# Altium project EE463_Project.PrjPcb
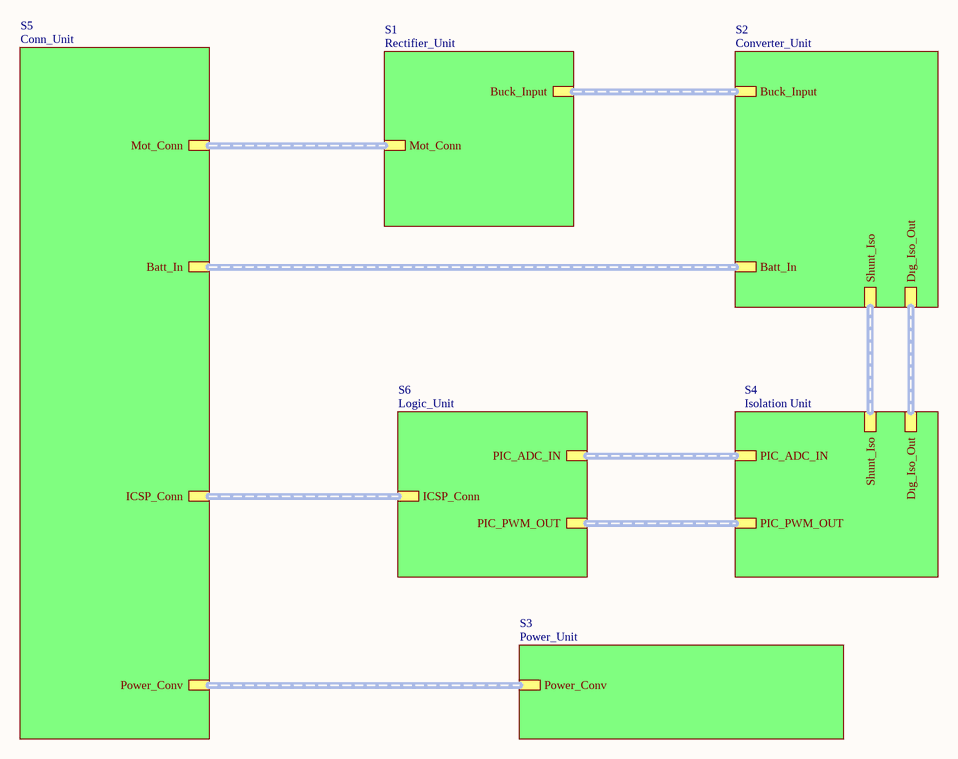
[diagram p0: EE463_Sch.SchDoc]
7 sheets, 52 parts. Net scope: hierarchical (ports join the sheet entries above them; power ports are global).
Board file: EE463_PCB.PcbDoc
Sheets:
  EE463_Sch.SchDoc
    S1 = Rectifier_Unit.SchDoc
    S2 = Converter_Unit.SchDoc
    S3 = Power_Unit.SchDoc
    S6 = Logic_Unit.SchDoc
    S5 = Conn_Unit.SchDoc
    S4 = Isolation Unit.SchDoc

## Sheet EE463_Sch.SchDoc
size A3

### Sub-sheets
S1 = Rectifier_Unit: Mot_Conn (harness Mot_Conn), Buck_Input (harness Rec_Buck)
S2 = Converter_Unit: Dıg_Iso_Out (harness DRV_In), Batt_In (harness Battery_In), Shunt_Iso (harness Shunt_Iso), Buck_Input (harness Rec_Buck)
S3 = Power_Unit: Power_Conv (harness Power_Conv)
S4 = Isolation Unit: Dıg_Iso_Out (harness DRV_In), PIC_ADC_IN (harness PIC_AN_IN), PIC_PWM_OUT (harness DIG_ISO_IN), Shunt_Iso (harness Shunt_Iso)
S5 = Conn_Unit: Mot_Conn (harness Mot_Conn), Batt_In (harness Battery_In), Power_Conv (harness Power_Conv), ICSP_Conn (harness ICSP_Conn)
S6 = Logic_Unit: PIC_ADC_IN (harness PIC_AN_IN), PIC_PWM_OUT (harness DIG_ISO_IN), ICSP_Conn (harness ICSP_Conn)

### Buses and harness runs
harness sheet S1/Buck_Input = sheet S2/Buck_Input
harness sheet S1/Mot_Conn = sheet S5/Mot_Conn
harness sheet S2/Batt_In = sheet S5/Batt_In
harness sheet S2/Dıg_Iso_Out = sheet S4/Dıg_Iso_Out
harness sheet S2/Shunt_Iso = sheet S4/Shunt_Iso
harness sheet S3/Power_Conv = sheet S5/Power_Conv
harness sheet S4/PIC_ADC_IN = sheet S6/PIC_ADC_IN
harness sheet S4/PIC_PWM_OUT = sheet S6/PIC_PWM_OUT
harness sheet S5/ICSP_Conn = sheet S6/ICSP_Conn

### Notes on the sheet
- Title
- Size:
- Date:
- A3
- Number:
- Time:
- Revision:
- Sheet
- of
- File:

## Sheet Rectifier_Unit.SchDoc
size A3
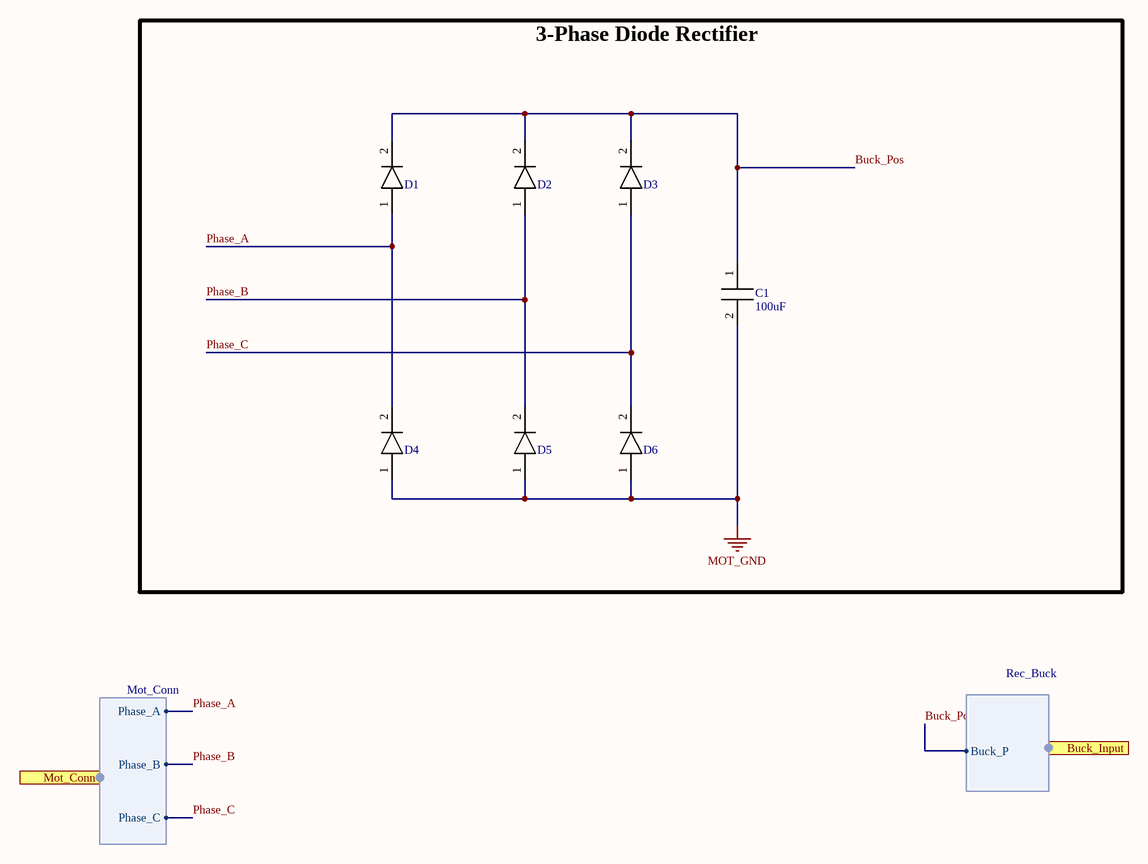
[diagram p1: Rectifier_Unit.SchDoc]

### Parts
C1  Parameter 1: 100uF  [EKXL401ELL101MM25S]  (hidden comment: CAP 100uf EKXL401ELL101MM25S)
D1  DI S2GTR  [S2GTR]  (value not drawn)
D2  DI S2GTR  [S2GTR]  (value not drawn)
D3  DI S2GTR  [S2GTR]  (value not drawn)
D4  DI S2GTR  [S2GTR]  (value not drawn)
D5  DI S2GTR  [S2GTR]  (value not drawn)
D6  DI S2GTR  [S2GTR]  (value not drawn)

### Ports
Buck_Input (harness Rec_Buck), Mot_Conn (harness Mot_Conn)

### Harnesses
Mot_Conn: Phase_A, Phase_B, Phase_C
Rec_Buck: Buck_P

### Nets
MOT_GND: C1.2 D4.1(Anode) D5.1(Anode) D6.1(Anode)
Buck_Pos: C1.1 D1.2(Cathode) D2.2(Cathode) D3.2(Cathode) ; port Buck_Input.Buck_P
Phase_A: D1.1(Anode) D4.2(Cathode) ; port Mot_Conn.Phase_A
Phase_B: D2.1(Anode) D5.2(Cathode) ; port Mot_Conn.Phase_B
Phase_C: D3.1(Anode) D6.2(Cathode) ; port Mot_Conn.Phase_C

### Notes on the sheet
- 3-Phase Diode Rectifier
- Title
- Size:
- Date:
- A3
- Number:
- Time:
- Revision:
- Sheet
- of
- File:

### Library data of the parts
D1-D6 = DI S2GTR: DI, S2GTR, 400V, 2A

## Sheet Converter_Unit.SchDoc
size A3
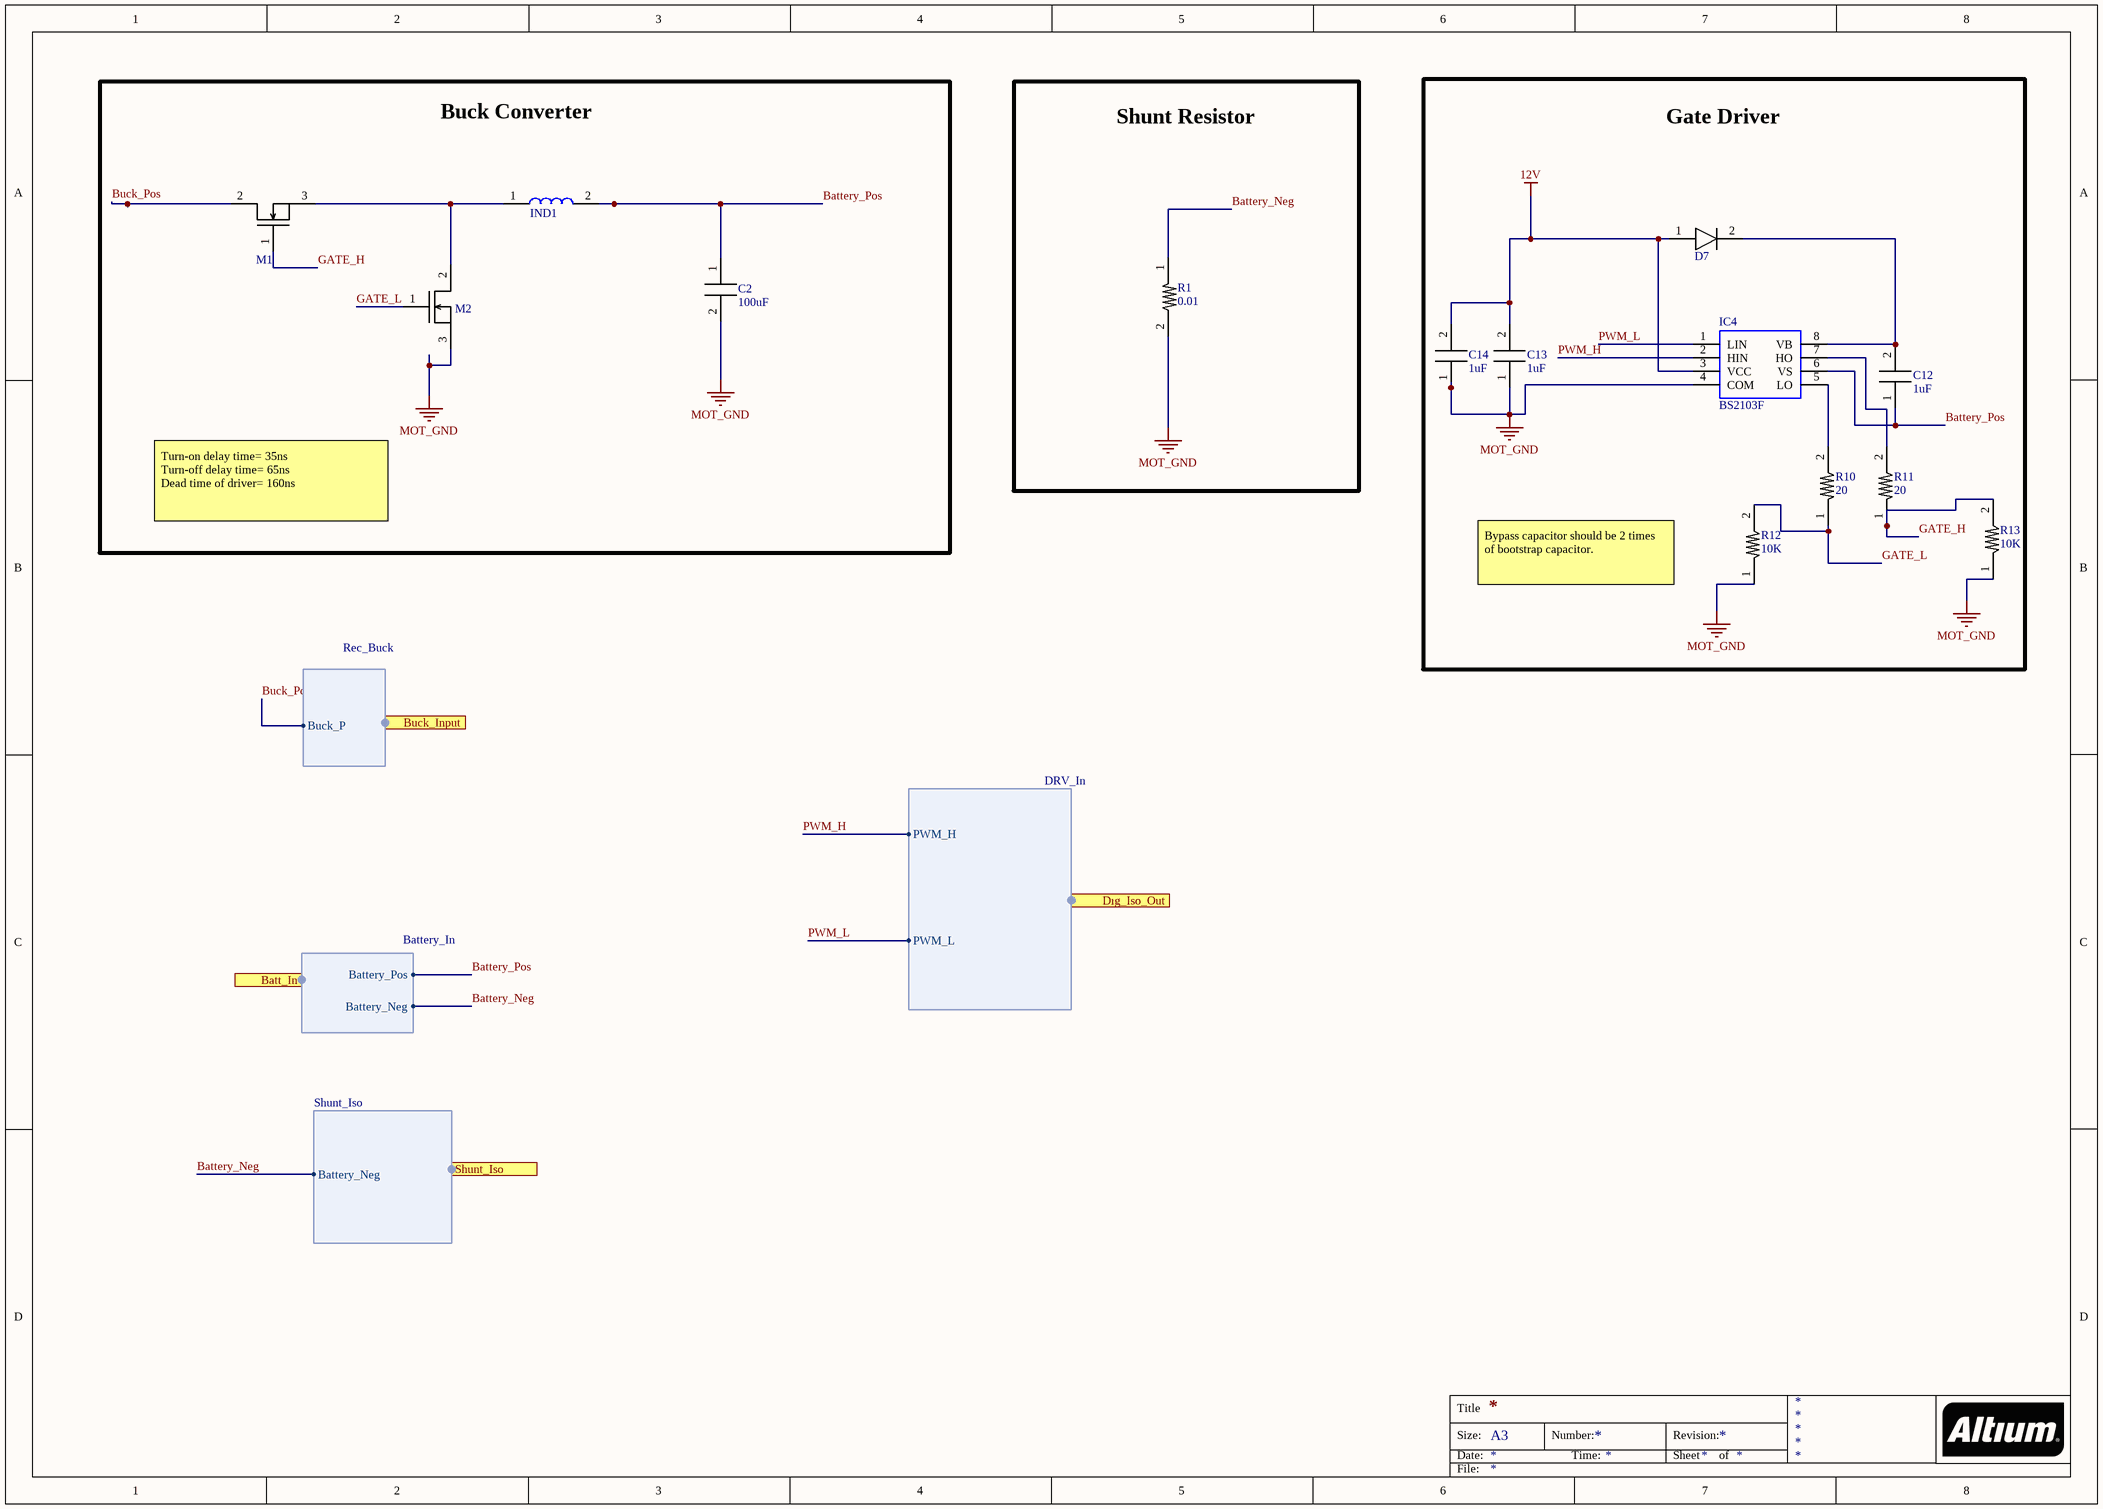
[diagram p2: Converter_Unit.SchDoc]

### Parts
C2  Parameter 1: 100uF  [860020573008]  (hidden comment: CAP 100uF 860020573008)
C12  Parameter 1: 1uF  [0603_CAP]  (hidden comment: CAP 1uF)
C13  Parameter 1: 1uF  [0603_CAP]  (hidden comment: CAP 1uF)
C14  Parameter 1: 1uF  [0603_CAP]  (hidden comment: CAP 1uF)
D7  DI S2GTR  [S2GTR]  (value not drawn)
IC4  BS2103F  [BS2103F]
IND1  IND, 1mH, B82615B2202M001  [AIRD]  (value not drawn)
M1  M?  [FDD5N50NZ]  (value not drawn)
M2  M?  [FDD5N50NZ]  (value not drawn)
R1  Parameter 1: 0.01  [RES_0402]  (hidden comment: RES, 0.01, 0402, Shunt)
R10  Parameter 1: 20  [0603_RES]  (hidden comment: RES, 20, 0603)
R11  Parameter 1: 20  [0603_RES]  (hidden comment: RES, 20, 0603)
R12  Parameter 1: 10K  [0603_RES]  (hidden comment: RES, 10K, 0603)
R13  Parameter 1: 10K  [0603_RES]  (hidden comment: RES, 10K, 0603)

### Ports
Batt_In (harness Battery_In), Buck_Input (harness Rec_Buck), Dıg_Iso_Out (harness DRV_In), Shunt_Iso (harness Shunt_Iso)

### Harnesses
Battery_In: Battery_Pos, Battery_Neg
DRV_In: PWM_H, PWM_L
Shunt_Iso: Battery_Neg
Rec_Buck: Buck_P

### Nets
12V: C13.2 C14.2 D7.1(Anode) IC4.3(VCC)
MOT_GND: C2.2 C13.1 C14.1 IC4.4(COM) M2.3 R1.2 R12.1 R13.1
Battery_Neg: R1.1 ; port Batt_In.Battery_Neg, port Shunt_Iso.Battery_Neg
Battery_Pos: C2.1 C12.1 IC4.6(VS) IND1.2 ; port Batt_In.Battery_Pos
Buck_Pos: M1.2 ; port Buck_Input.Buck_P
GATE_H: M1.1 R11.1 R13.2
GATE_L: M2.1 R10.1 R12.2
PWM_H: IC4.2(HIN) ; port Dıg_Iso_Out.PWM_H
PWM_L: IC4.1(LIN) ; port Dıg_Iso_Out.PWM_L
NetC12_2: C12.2 D7.2(Cathode) IC4.8(VB)
NetIC4_5: IC4.5(LO) R10.2
NetIC4_7: IC4.7(HO) R11.2
NetIND1_1: IND1.1 M1.3 M2.2

### Notes on the sheet
- Buck Converter
- Shunt Resistor
- Gate Driver
- Turn-on delay time= 35ns
  Turn-off delay time= 65ns
  Dead time of driver= 160ns
- Bypass capacitor should be 2 times of bootstrap capacitor.
- Title
- Size:
- Date:
- A3
- Number:
- Time:
- Revision:
- Sheet
- of
- File:

### Library data of the parts
D7 = DI S2GTR: DI, S2GTR, 400V, 2A
IC4 = IC DRV, HALF-B, BS2103F
IND1 = IND, 1mH, B82615B2202M001: IND, 5mH, B82615B2202M001, 250V, 2A
M1 M2 = MOS, N-CH, FDD5N550NZ: MOS, N-CH, FDD5N550NZ, 2A
R1 = RES, 0.01, 0402, Shunt: RES, 0.01, 0402, Shunt, CSS0402FT10L0

## Sheet Power_Unit.SchDoc
size A3
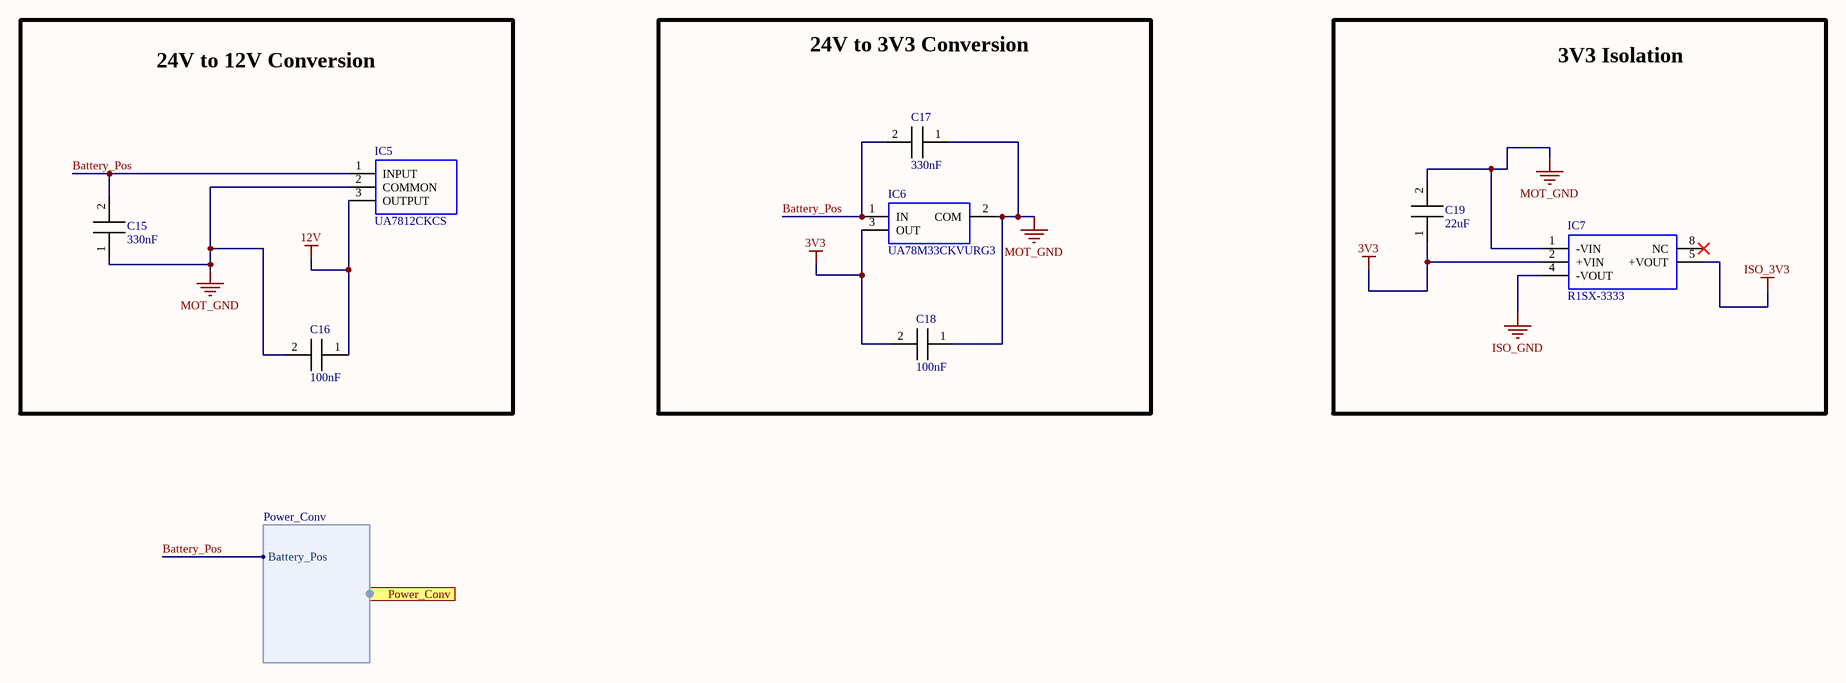
[diagram p3: Power_Unit.SchDoc]

### Parts
C15  Parameter 1: 330nF  [0603_CAP]  (hidden comment: CAP 330nF)
C16  Parameter 1: 100nF  [0603_CAP]  (hidden comment: CAP 100nF)
C17  Parameter 1: 330nF  [0603_CAP]  (hidden comment: CAP 330nF)
C18  Parameter 1: 100nF  [0603_CAP]  (hidden comment: CAP 100nF)
C19  Parameter 1: 22uF  [0603_CAP]  (hidden comment: CAP  22uF)
IC5  UA7812CKCS  [UA7812CKCS]
IC6  UA78M33CKVURG3  [UA78M33CKVURG3]
IC7  R1SX-3333  [R1SX_3333]

### Ports
Power_Conv (harness Power_Conv)

### Harnesses
Power_Conv: Battery_Pos

### Nets
3V3: C18.2 C19.1 IC6.3(OUT) IC7.2(+VIN)
12V: C16.1 IC5.3(OUTPUT)
ISO_3V3: IC7.5(+VOUT)
ISO_GND: IC7.4(-VOUT)
MOT_GND: C15.1 C16.2 C17.1 C18.1 C19.2 IC5.2(COMMON) IC6.2(COM) IC7.1(-VIN)
Battery_Pos: C15.2 C17.2 IC5.1(INPUT) IC6.1(IN) ; port Power_Conv.Battery_Pos

Not connected (* = marked no-connect by the designer): IC7 8(NC)*

### Notes on the sheet
- 24V to 12V Conversion
- (near C17) 24V to 3V3 Conversion
- 3V3 Isolation
- Title
- Size:
- Date:
- A3
- Number:
- Time:
- Revision:
- Sheet
- of
- File:

### Library data of the parts
IC5 = IC, LVR, UA7812CKCS
IC6 = IC, LVR, UA78M33CKVURG3, 24/3V3
IC7 = IC, DC/DC, ISO, R1SX-3333

## Sheet Logic_Unit.SchDoc
size A3
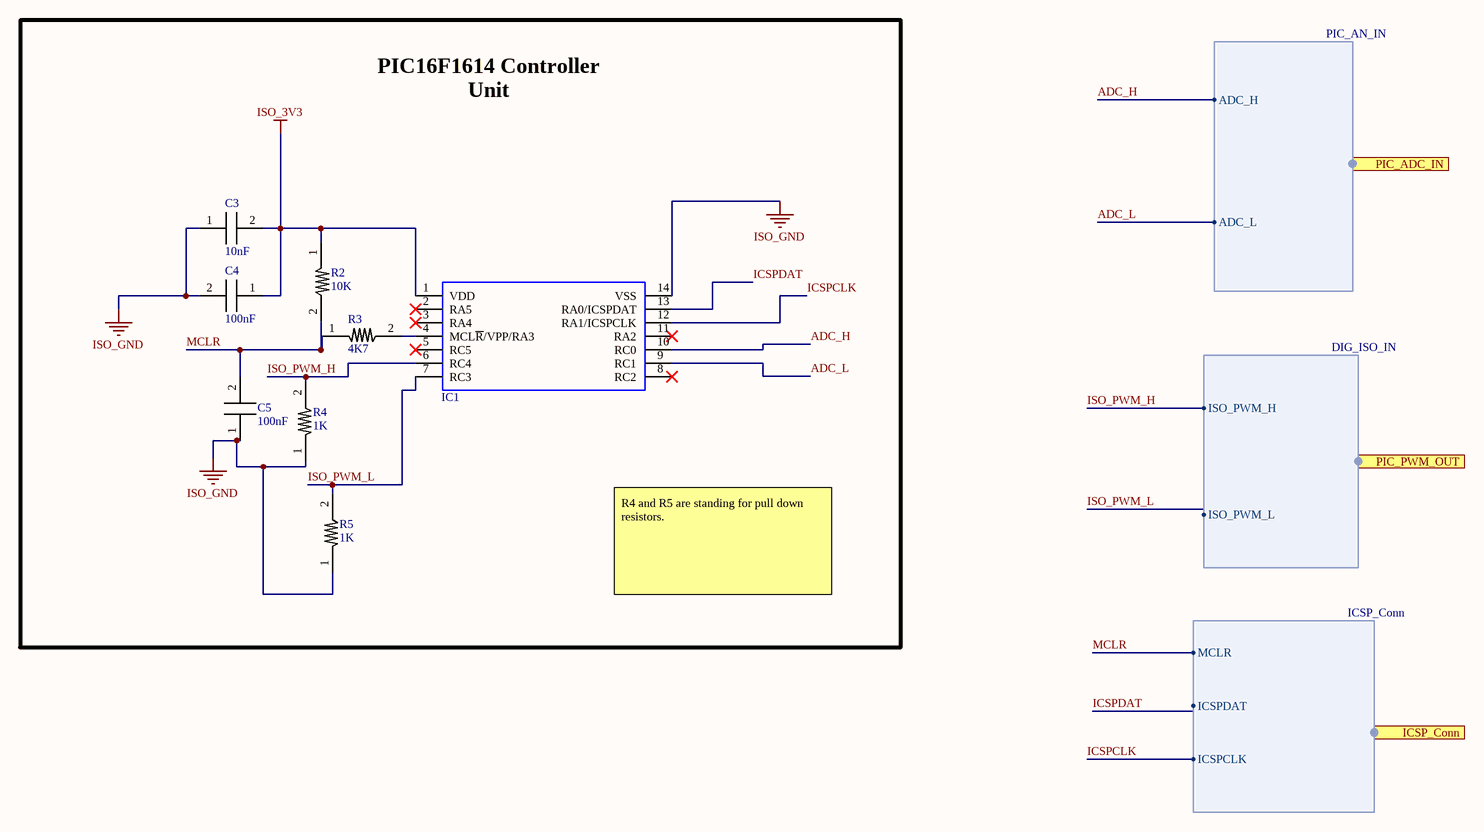
[diagram p4: Logic_Unit.SchDoc]

### Parts
C3  Parameter 1: 10nF  [0603_CAP]  (hidden comment: CAP 10nF)
C4  Parameter 1: 100nF  [0603_CAP]  (hidden comment: CAP 100nF)
C5  Parameter 1: 100nF  [0603_CAP]  (hidden comment: CAP 100nF)
IC1  PIC16F1614  [PIC16F1613]  (value not drawn)
R2  Parameter 1: 10K  [0603_RES]  (hidden comment: RES, 10K, 0603)
R3  Parameter 1: 4K7  [0603_RES]  (hidden comment: RES, 4K7, 0603)
R4  Parameter 1: 1K  [0603_RES]  (hidden comment: RES, 1K, 0603)
R5  Parameter 1: 1K  [0603_RES]  (hidden comment: RES, 1K, 0603)

### Ports
ICSP_Conn (harness ICSP_Conn), PIC_ADC_IN (harness PIC_AN_IN), PIC_PWM_OUT (harness DIG_ISO_IN)

### Harnesses
PIC_AN_IN: ADC_H, ADC_L
DIG_ISO_IN: ISO_PWM_H, ISO_PWM_L
ICSP_Conn: MCLR, ICSPDAT, ICSPCLK

### Nets
ISO_3V3: C3.2 C4.1 IC1.1(VDD) R2.1
ISO_GND: C3.1 C4.2 C5.1 IC1.14(VSS) R4.1 R5.1
ADC_H: IC1.10(RC0) ; port PIC_ADC_IN.ADC_H
ADC_L: IC1.9(RC1) ; port PIC_ADC_IN.ADC_L
ICSPCLK: IC1.12(RA1/ICSPCLK) ; port ICSP_Conn.ICSPCLK
ICSPDAT: IC1.13(RA0/ICSPDAT) ; port ICSP_Conn.ICSPDAT
ISO_PWM_H: IC1.6(RC4) R4.2 ; port PIC_PWM_OUT.ISO_PWM_H
ISO_PWM_L: IC1.7(RC3) R5.2 ; port PIC_PWM_OUT.ISO_PWM_L
MCLR: C5.2 R2.2 R3.1 ; port ICSP_Conn.MCLR
NetIC1_4: IC1.4(MCL~{R}/VPP/RA3) R3.2

Not connected (* = marked no-connect by the designer): IC1 2(RA5)* 3(RA4)* 5(RC5)* 8(RC2)* 11(RA2)*

### Notes on the sheet
- PIC16F1614 Controller Unit
- R4 and R5 are standing for pull down resistors.

### Library data of the parts
IC1 = IC PIC16, PIC16F1614

## Sheet Conn_Unit.SchDoc
size A3
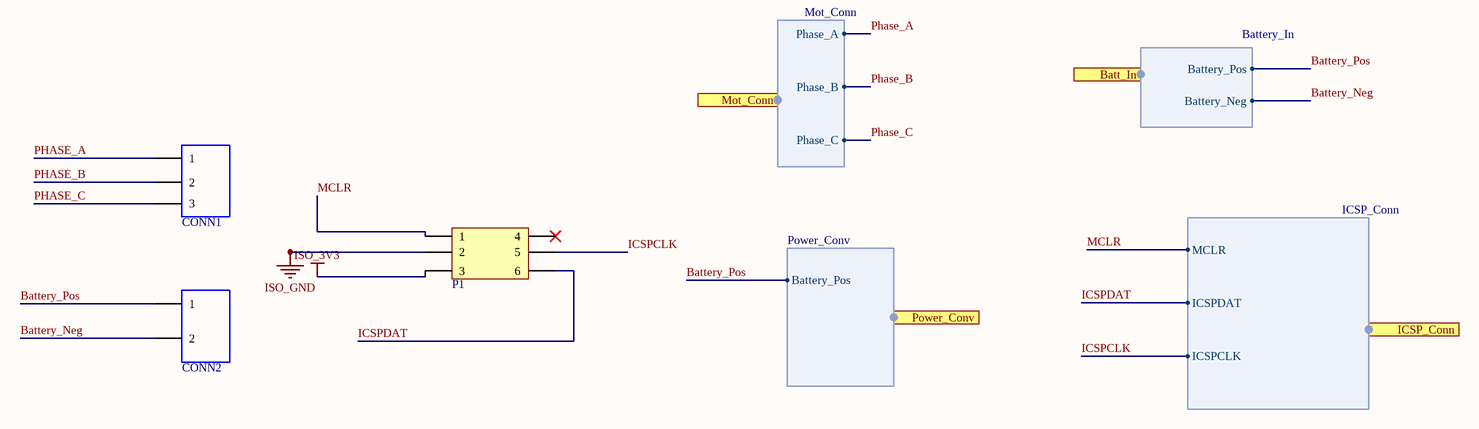
[diagram p5: Conn_Unit.SchDoc]

### Parts
CONN1  CONN KLE3  [kle3]  (value not drawn)
CONN2  CONN KLE2  [kle2]  (value not drawn)
P1  H3X2  [H3X2]  (value not drawn)

### Ports
Batt_In (harness Battery_In), ICSP_Conn (harness ICSP_Conn), Mot_Conn (harness Mot_Conn), Power_Conv (harness Power_Conv)

### Harnesses
Mot_Conn: Phase_A, Phase_B, Phase_C
Battery_In: Battery_Pos, Battery_Neg
Power_Conv: Battery_Pos
ICSP_Conn: MCLR, ICSPDAT, ICSPCLK

### Nets
ISO_3V3: P1.3
ISO_GND: P1.2
Battery_Neg: CONN2.2 ; port Batt_In.Battery_Neg
Battery_Pos: CONN2.1 ; port Batt_In.Battery_Pos, port Power_Conv.Battery_Pos
ICSPCLK: P1.5 ; port ICSP_Conn.ICSPCLK
ICSPDAT: P1.6 ; port ICSP_Conn.ICSPDAT
MCLR: P1.1 ; port ICSP_Conn.MCLR
Phase_A: CONN1.1 ; port Mot_Conn.Phase_A
Phase_B: CONN1.2 ; port Mot_Conn.Phase_B
Phase_C: CONN1.3 ; port Mot_Conn.Phase_C

Not connected (* = marked no-connect by the designer): P1 4*

### Notes on the sheet
- Title
- Size:
- Date:
- A3
- Number:
- Time:
- Revision:
- Sheet
- of
- File:

## Sheet Isolation Unit.SchDoc
size A4
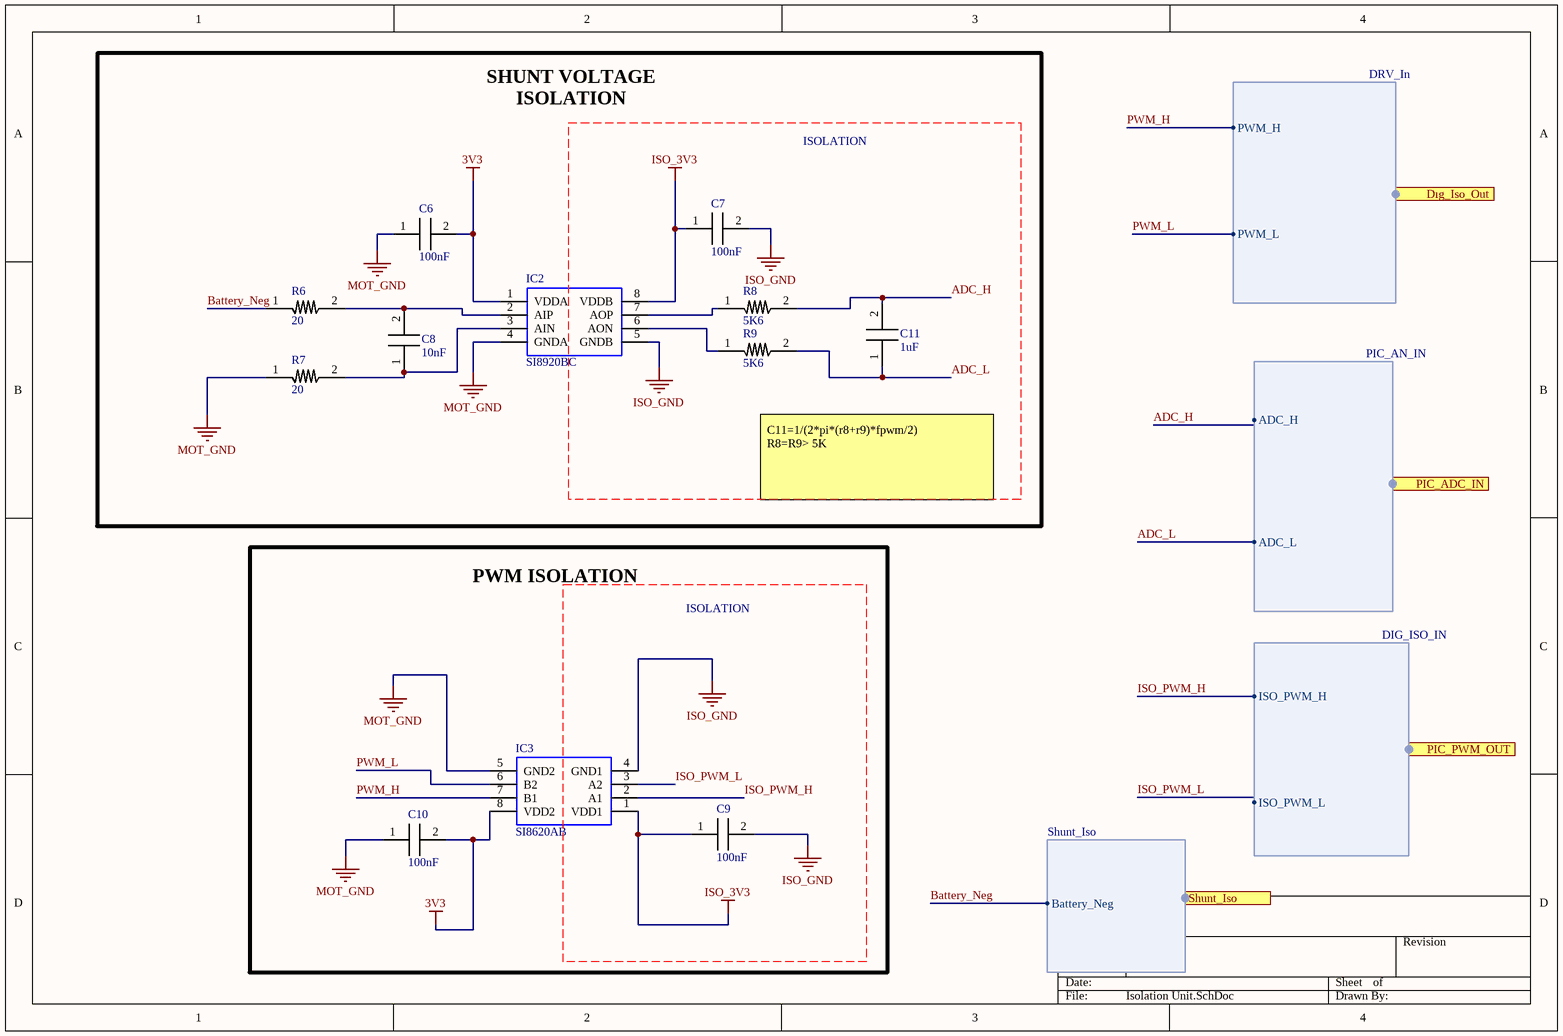
[diagram p6: Isolation Unit.SchDoc]

### Parts
C6  Parameter 1: 100nF  [0603_CAP]  (hidden comment: CAP 100nF)
C7  Parameter 1: 100nF  [0603_CAP]  (hidden comment: CAP 100nF)
C8  Parameter 1: 10nF  [0603_CAP]  (hidden comment: CAP 10nF)
C9  Parameter 1: 100nF  [0603_CAP]  (hidden comment: CAP 100nF)
C10  Parameter 1: 100nF  [0603_CAP]  (hidden comment: CAP 100nF)
C11  Parameter 1: 1uF  [0603_CAP]  (hidden comment: CAP 1uF)
IC2  SI8920BC  [SI8920BC-IP]
IC3  SI8620AB  [SI8620AB]
R6  Parameter 1: 20  [0603_RES]  (hidden comment: RES, 20, 0603)
R7  Parameter 1: 20  [0603_RES]  (hidden comment: RES, 20, 0603)
R8  Parameter 1: 5K6  [0603_RES]  (hidden comment: RES, 5K6, 0603)
R9  Parameter 1: 5K6  [0603_RES]  (hidden comment: RES, 5K6, 0603)

### Blocks framed on the sheet
ISOLATION: C6-C8 C11 IC2 R6-R9
ISOLATION: C9 C10 IC3

### Ports
Dıg_Iso_Out (harness DRV_In), PIC_ADC_IN (harness PIC_AN_IN), PIC_PWM_OUT (harness DIG_ISO_IN), Shunt_Iso (harness Shunt_Iso)

### Harnesses
DRV_In: PWM_H, PWM_L
PIC_AN_IN: ADC_H, ADC_L
DIG_ISO_IN: ISO_PWM_H, ISO_PWM_L
Shunt_Iso: Battery_Neg

### Nets
3V3: C6.2 C10.2 IC2.1(VDDA) IC3.8(VDD2)
ISO_3V3: C7.1 C9.1 IC2.8(VDDB) IC3.1(VDD1)
ISO_GND: C7.2 C9.2 IC2.5(GNDB) IC3.4(GND1)
MOT_GND: C6.1 C10.1 IC2.4(GNDA) IC3.5(GND2) R7.1
ADC_H: C11.2 R8.2 ; port PIC_ADC_IN.ADC_H
ADC_L: C11.1 R9.2 ; port PIC_ADC_IN.ADC_L
Battery_Neg: R6.1 ; port Shunt_Iso.Battery_Neg
ISO_PWM_H: IC3.2(A1) ; port PIC_PWM_OUT.ISO_PWM_H
ISO_PWM_L: IC3.3(A2) ; port PIC_PWM_OUT.ISO_PWM_L
PWM_H: IC3.7(B1) ; port Dıg_Iso_Out.PWM_H
PWM_L: IC3.6(B2) ; port Dıg_Iso_Out.PWM_L
NetC8_1: C8.1 IC2.3(AIN) R7.2
NetC8_2: C8.2 IC2.2(AIP) R6.2
NetIC2_6: IC2.6(AON) R9.1
NetIC2_7: IC2.7(AOP) R8.1

### Notes on the sheet
- SHUNT VOLTAGE ISOLATION
- C11=1/(2*pi*(r8+r9)*fpwm/2)
  R8=R9> 5K
- PWM ISOLATION

### Library data of the parts
IC2 = IC ISO OP-AMP,SI8920BC
IC3 = IC ISO DIG, SI8620AB

## Nets that join several sheets
3V3: Power_Unit (C18.2 C19.1 IC6.3 IC7.2), Isolation Unit (C6.2 C10.2 IC2.1 IC3.8)
12V: Converter_Unit (C13.2 C14.2 D7.1 IC4.3), Power_Unit (C16.1 IC5.3)
ISO_3V3: Power_Unit (IC7.5), Logic_Unit (C3.2 C4.1 IC1.1 R2.1), Conn_Unit (P1.3), Isolation Unit (C7.1 C9.1 IC2.8 IC3.1)
ISO_GND: Power_Unit (IC7.4), Logic_Unit (6 pins), Conn_Unit (P1.2), Isolation Unit (C7.2 C9.2 IC2.5 IC3.4)
MOT_GND: Rectifier_Unit (C1.2 D4.1 D5.1 D6.1), Converter_Unit (8 pins), Power_Unit (8 pins), Isolation Unit (5 pins)
ADC_H: Logic_Unit (IC1.10), Isolation Unit (C11.2 R8.2)
ADC_L: Logic_Unit (IC1.9), Isolation Unit (C11.1 R9.2)
Battery_Neg: Converter_Unit (R1.1), Conn_Unit (CONN2.2), Isolation Unit (R6.1)
Battery_Pos: Converter_Unit (C2.1 C12.1 IC4.6 IND1.2), Power_Unit (C15.2 C17.2 IC5.1 IC6.1), Conn_Unit (CONN2.1)
Buck_Pos: Rectifier_Unit (C1.1 D1.2 D2.2 D3.2), Converter_Unit (M1.2)
ICSPCLK: Logic_Unit (IC1.12), Conn_Unit (P1.5)
ICSPDAT: Logic_Unit (IC1.13), Conn_Unit (P1.6)
ISO_PWM_H: Logic_Unit (IC1.6 R4.2), Isolation Unit (IC3.2)
ISO_PWM_L: Logic_Unit (IC1.7 R5.2), Isolation Unit (IC3.3)
MCLR: Logic_Unit (C5.2 R2.2 R3.1), Conn_Unit (P1.1)
Phase_A: Rectifier_Unit (D1.1 D4.2), Conn_Unit (CONN1.1)
Phase_B: Rectifier_Unit (D2.1 D5.2), Conn_Unit (CONN1.2)
Phase_C: Rectifier_Unit (D3.1 D6.2), Conn_Unit (CONN1.3)
PWM_H: Converter_Unit (IC4.2), Isolation Unit (IC3.7)
PWM_L: Converter_Unit (IC4.1), Isolation Unit (IC3.6)